# EAGLE schematic ModWalkM (EAGLE 9.6.2)
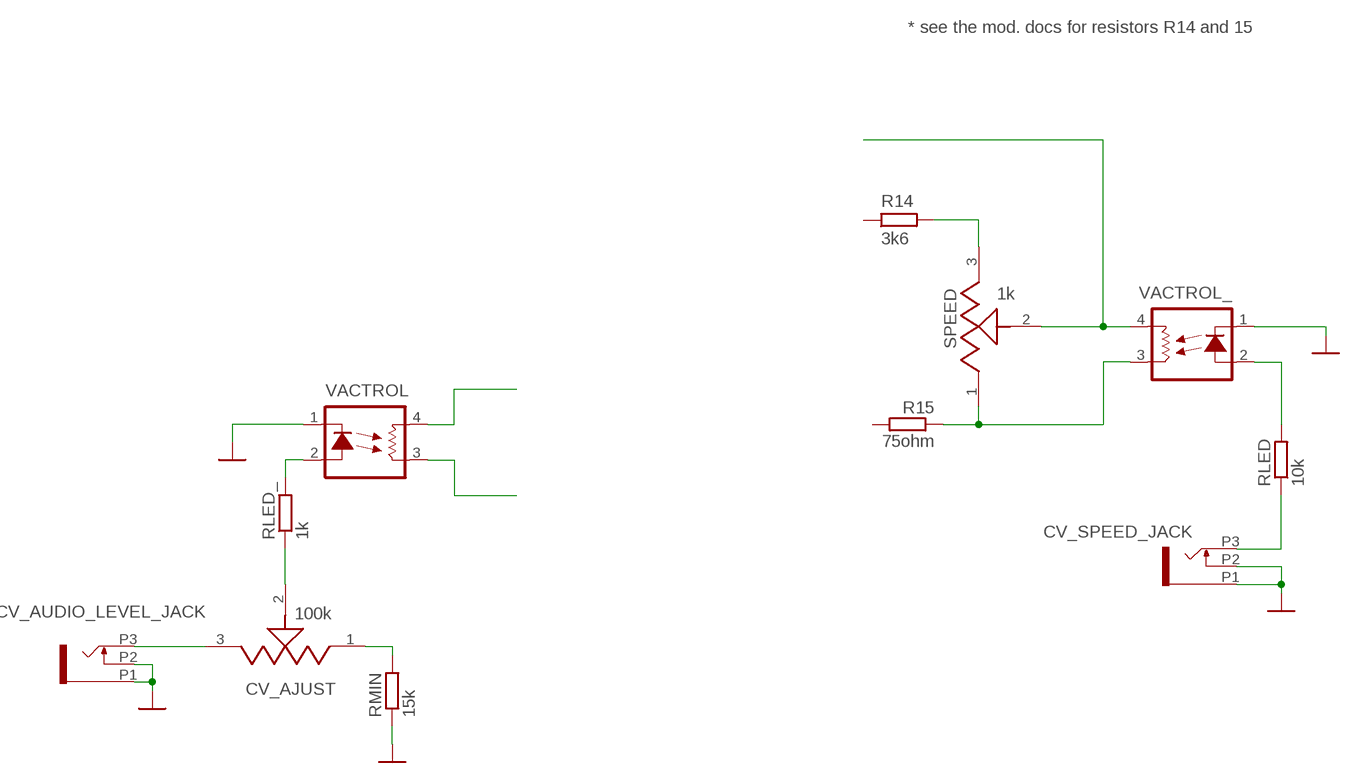
[diagram p0: schematic, sheet 1]

## Parts
CV_AJUST  100k  POT_VERTICAL_R1212  [POT_VERTICAL_R1212]
CV_AUDIO_LEVEL_JACK  PJ301_THONKICONN6  [WQP_PJ_301M6]
CV_SPEED_JACK  PJ301_THONKICONN6  [WQP_PJ_301M6]
R14  3k6  R-EU_0204/5  [0204/5]
R15  75ohm  R-EU_0204/5  [0204/5]
RLED  10k  R-EU_0204/5  [0204/5]
RLED_  1k  R-EU_0204/5  [0204/5]
RMIN  15k  R-EU_0204/5  [0204/5]
SPEED  1k  POT_VERTICAL_R1212  [POT_VERTICAL_R1212]
VACTROL  VTL5C10  [VTL5C]
VACTROL_  VTL5C10  [VTL5C]

## Nets
GND: CV_AUDIO_LEVEL_JACK.P1 CV_AUDIO_LEVEL_JACK.P2 CV_SPEED_JACK.P1 CV_SPEED_JACK.P2 RMIN.1 VACTROL.1(C) VACTROL_.1(C)
N$1: SPEED.2 VACTROL_.4(L2)
N$2: R14.2 SPEED.3
N$3: CV_AJUST.2 RLED_.1
N$4: CV_AJUST.3 CV_AUDIO_LEVEL_JACK.P3
N$5: CV_AJUST.1 RMIN.2
N$6: RLED_.2 VACTROL.2(A)
N$7: R15.1 SPEED.1 VACTROL_.3(L1)
N$8: RLED.2 VACTROL_.2(A)
N$9: CV_SPEED_JACK.P3 RLED.1
N$10: VACTROL.4(L2)
N$11: VACTROL.3(L1)
Unconnected: R14.1 R15.2

## Notes on the sheet
- * see the mod. docs for resistors R14 and 15

## Library data of the parts
CV_AJUST SPEED = Potenciometres:POT_VERTICAL_R1212
CV_AUDIO_LEVEL_JACK CV_SPEED_JACK = og-pj301:PJ301_THONKICONN
R14 R15 RLED RLED_ RMIN = rcl:R-EU_: RESISTOR, European symbol
VACTROL VACTROL_ = optocoupler:VTL5C*: Low Cost Axial Vactrols Source: www.perkinelmer.com/opto ... vtl5c9_c10.pdf; MPN: VTL5C10; OC_FARNELL: unknown; OC_NEWARK: 98F3580